# EAGLE design mit antenne_entfernt_3 (EAGLE 8.2.2)
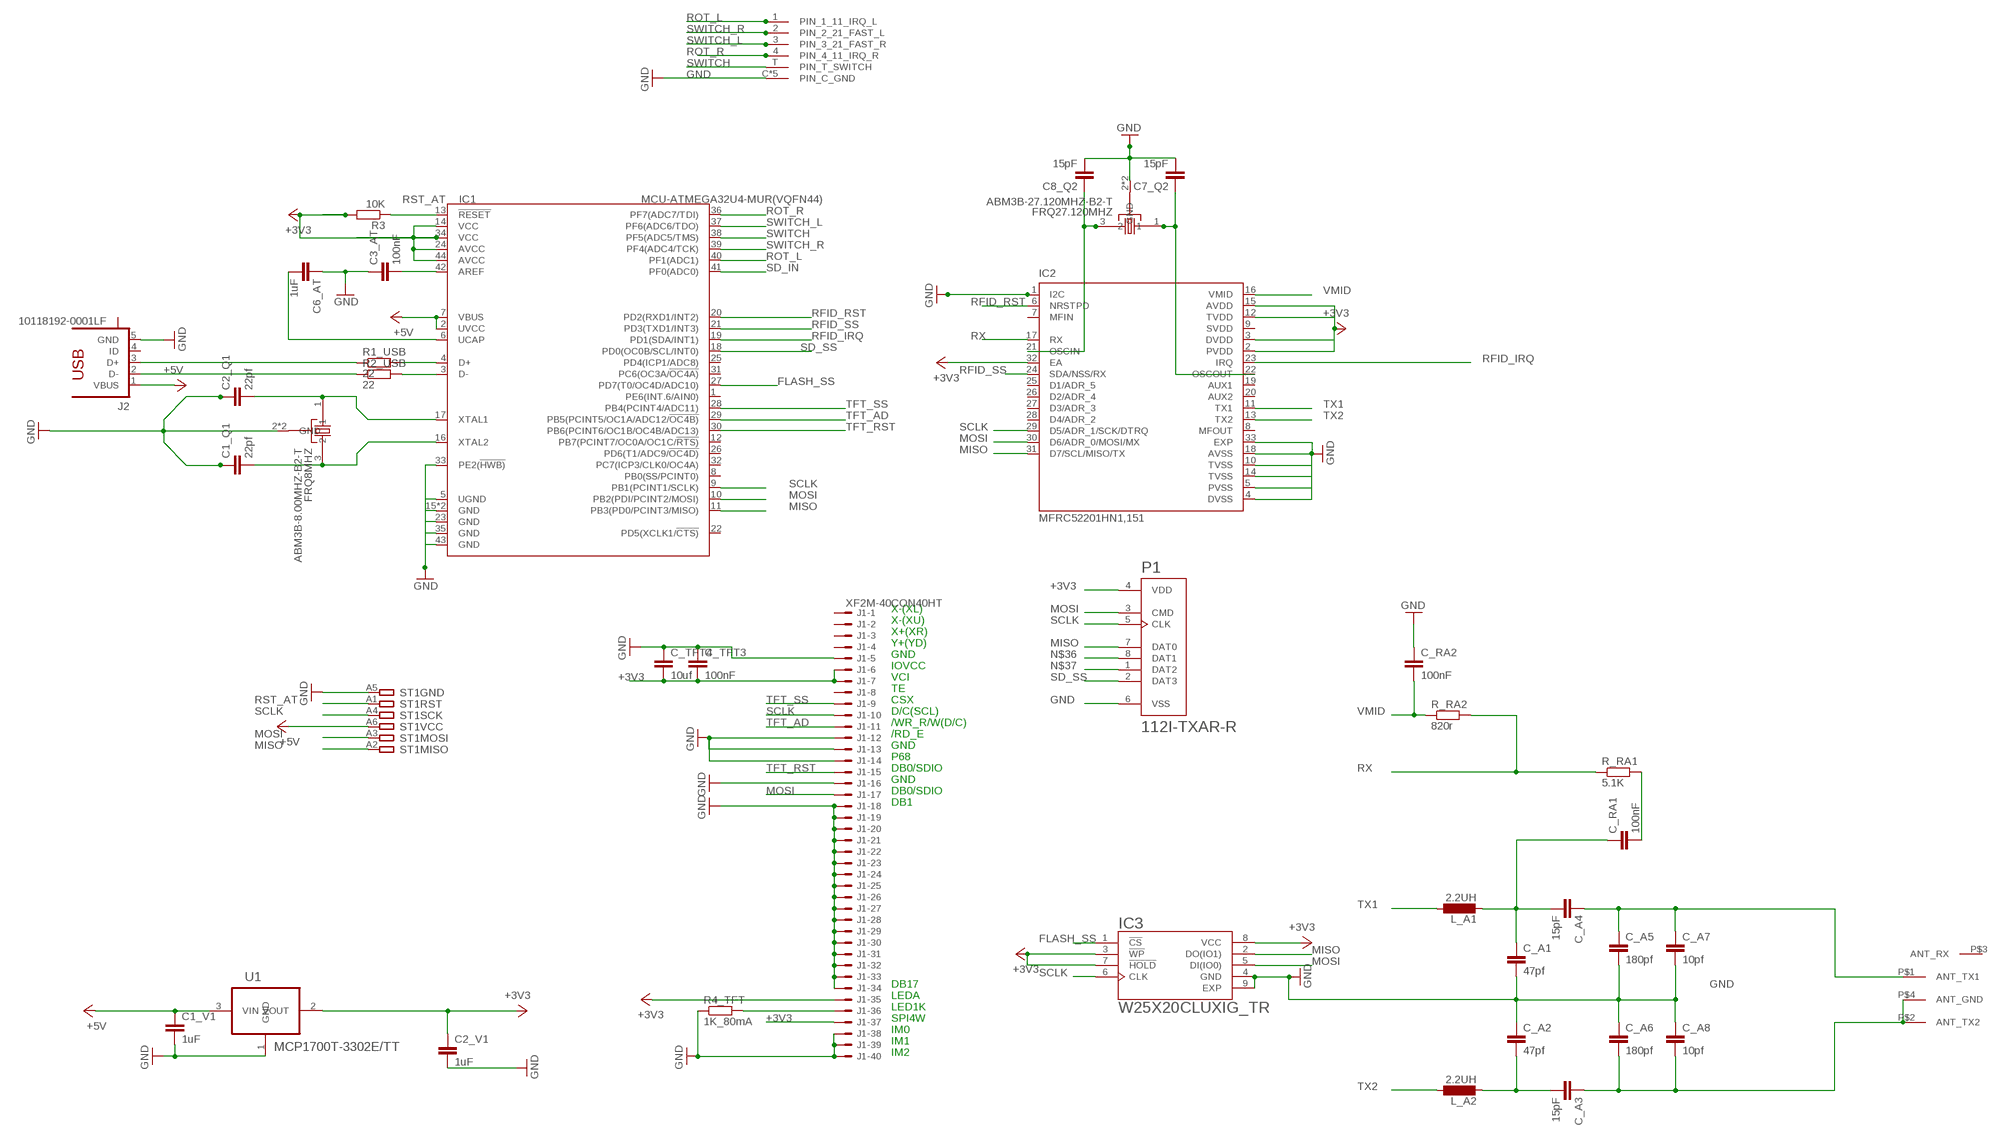
[diagram p0: schematic, sheet 1]

## Parts
C1_Q1  22pf  C-EUC0402K  [C0402K]
C1_V1  1uF  C-EUC0402K  [C0402K]
C2_Q1  22pf  C-EUC0402K  [C0402K]
C2_V1  1uF  C-EUC0402K  [C0402K]
C3_AT  100nF  C-EUC0402K  [C0402K]
C6_AT  1uF  C-EUC0402K  [C0402K]
C7_Q2  15pF  C-EUC0402K  [C0402K]
C8_Q2  15pF  C-EUC0402K  [C0402K]
C_A1  47pf  C-EUC0402K  [C0402K]
C_A2  47pf  C-EUC0402K  [C0402K]
C_A3  15pF  C-EUC0402K  [C0402K]
C_A4  15pF  C-EUC0603K  [C0603K]
C_A5  180pf  C-EUC0402K  [C0402K]
C_A6  180pf  C-EUC0402K  [C0402K]
C_A7  10pf  C-EUC0402K  [C0402K]
C_A8  10pf  C-EUC0402K  [C0402K]
C_RA1  100nF  C-EUC0402K  [C0402K]
C_RA2  100nF  C-EUC0402K  [C0402K]
C_TFT3  100nF  C-EUC0402K  [C0402K]
C_TFT4  10uf  C-EUC0402K  [C0402K]
FRQ8MHZ  ABM3B-8.00MHZ-B2-T  ABM3B-8.000MHZ-B2-T  [OSCSC500X320X110-4N]
FRQ27.120MHZ  ABM3B-27.120MHZ-B2-T  [OSCSC500X320X110-4N]
IC1  MCU-ATMEGA32U4-MUR(VQFN44)  [QFN44G-0.5-7X7MM]
IC2  MFRC52201HN1,151  [QFN50P500X500X100-33N]
IC3  W25X20CLUXIG_TR  [SON50P300X200X60-9N]
J1  XF2M-40CON40HT  [XF2M-4015-1F]
J2  10118192-0001LF  [10118192-0001LF]
L_A1  2.2UH  L-EUL2012C  [L2012C]
L_A2  2.2UH  L-EUL2012C  [L2012C]
P1  112I-TXAR-R  [112I-TXAR-R]
R1_USB  22  R-EU_R0402  [R0402]
R2_USB  22  R-EU_R0402  [R0402]
R3  10K  R-EU_R0402  [R0402]
R4_TFT  1K_80mA  R-EU_R0402  [R0402]
R_RA1  5.1K  R-EU_R0402  [R0402]
R_RA2  820r  R-EU_R0402  [R0402]
S1  WIPPSCHALTER_SCHWARZ_5WEGE  [SMD_SWITCH1]
S3  ANTENNE  [ANTENNE_ENIGMA_34X44]
ST1  ISA  IBM8BIT  [IBM8BIT]
U1  MCP1700T-3302E/TT  [SOT95P237X112-3N]

## Nets
+3V3: C2_V1.1 C_TFT3.2 C_TFT4.2 IC1.14(VCC) IC1.24(AVCC) IC1.34(VCC) IC1.44(AVCC) IC2.2(PVDD) IC2.3(DVDD) IC2.12(TVDD) IC2.15(AVDD) IC2.32(EA) IC3.3(!WP) IC3.7(!HOLD) IC3.8(VCC) J1.4 J1.6 J1.34 J1.35 P1.4(VDD) R3.2 U1.2(VOUT)
+5V: C1_V1.1 IC1.2(UVCC) IC1.7(VBUS) J2.1(VBUS) ST1.A6 U1.3(VIN)
FLASH_SS: IC1.27(PD7(T0/OC4D/ADC10)) IC3.1(!CS)
GND: C1_Q1.1 C1_V1.2 C2_Q1.1 C2_V1.2 C3_AT.1 C6_AT.1 C7_Q2.2 C8_Q2.2 C_A1.2 C_A2.1 C_A5.2 C_A6.1 C_A7.2 C_A8.1 C_RA2.1 C_TFT3.1 C_TFT4.1 FRQ8MHZ.2(GND) FRQ8MHZ.4(GND) FRQ27.120MHZ.2(GND) FRQ27.120MHZ.4(GND) IC1.5(UGND) IC1.15(GND) IC1.23(GND) IC1.33(PE2(!HWB)) IC1.35(GND) IC1.43(GND) IC1.TAB(GND) IC2.1(I2C) IC2.4(DVSS) IC2.5(PVSS) IC2.10(TVSS) IC2.14(TVSS) IC2.18(AVSS) IC2.33(EXP) IC3.4(GND) IC3.9(EXP) J1.1 J1.2 J1.3 J1.7 J1.8 J1.9 J1.10 J1.11 J1.12 J1.13 J1.14 J1.15 J1.16 J1.17 J1.18 J1.19 J1.20 J1.21 J1.22 J1.23 J1.25 J1.27 J1.28 J1.29 J1.36 J1.M1 J1.M2 J2.5(GND) P1.6(VSS) R4_TFT.1 S1.C(PIN_C_GND) S1.C_1(PIN_C_GND) S1.C_2(PIN_C_GND) S1.C_3(PIN_C_GND) S1.GND_TERMINAL(PIN_C_GND) ST1.A5 U1.1(GND)
MISO: IC1.11(PB3(PD0/PCINT3/MISO)) IC2.31(D7/SCL/MISO/TX) IC3.2(DO(IO1)) P1.7(DAT0) ST1.A2
MOSI: IC1.10(PB2(PDI/PCINT2/MOSI)) IC2.30(D6/ADR_0/MOSI/MX) IC3.5(DI(IO0)) J1.24 P1.3(CMD) ST1.A3
N$1: C1_Q1.2 FRQ8MHZ.3 IC1.16(XTAL2)
N$2: C2_Q1.2 FRQ8MHZ.1 IC1.17(XTAL1)
N$3: C8_Q2.1 FRQ27.120MHZ.3 IC2.21(OSCIN)
N$4: IC1.4(D+) R1_USB.2
N$5: IC1.3(D-) R2_USB.2
N$6: J2.3(D+) R1_USB.1
N$7: J2.2(D-) R2_USB.1
N$8: C7_Q2.1 FRQ27.120MHZ.1 IC2.22(OSCOUT)
N$9: C_A3.1 C_A6.2 C_A8.2 S3.P$2(ANT_TX2) S3.P$4(ANT_GND)
N$10: C3_AT.2 IC1.42(AREF)
N$13: C6_AT.2 IC1.6(UCAP)
N$15: J1.5 R4_TFT.2
N$21: C_RA1.2 R_RA1.2
N$23: C_A2.2 C_A3.2 L_A2.2
N$32: C_A1.1 C_A4.2 C_RA1.1 L_A1.2
N$33: C_A4.1 C_A5.1 C_A7.1 S3.P$1(ANT_TX1)
N$36: P1.8(DAT1)
N$37: P1.1(DAT2)
RFID_IRQ: IC1.19(PD1(SDA/INT1)) IC2.23(IRQ)
RFID_RST: IC1.20(PD2(RXD1/INT2)) IC2.6(NRSTPD)
RFID_SS: IC1.21(PD3(TXD1/INT3)) IC2.24(SDA/NSS/RX)
ROT_L: IC1.40(PF1(ADC1)) S1.1(PIN_1_11_IRQ_L)
ROT_R: IC1.36(PF7(ADC7/TDI)) S1.4(PIN_4_11_IRQ_R)
RST_AT: IC1.13(!RESET) R3.1 ST1.A1
RX: IC2.17(RX) R_RA1.1 R_RA2.2
SCLK: IC1.9(PB1(PCINT1/SCLK)) IC2.29(D5/ADR_1/SCK/DTRQ) IC3.6(CLK) J1.31 P1.5(CLK) ST1.A4
SD_IN: IC1.41(PF0(ADC0))
SD_SS: IC1.18(PD0(OC0B/SCL/INT0)) P1.2(DAT3)
SWITCH: IC1.38(PF5(ADC5/TMS)) S1.T(PIN_T_SWITCH)
SWITCH_L: IC1.37(PF6(ADC6/TDO)) S1.3(PIN_3_21_FAST_R)
SWITCH_R: IC1.39(PF4(ADC4/TCK)) S1.2(PIN_2_21_FAST_L)
TFT_AD: IC1.29(PB5(PCINT5/OC1A/ADC12/!OC4B)) J1.30
TFT_RST: IC1.30(PB6(PCINT6/OC1B/OC4B/ADC13)) J1.26
TFT_SS: IC1.28(PB4(PCINT4/ADC11)) J1.32
TX1: IC2.11(TX1) L_A1.1
TX2: IC2.13(TX2) L_A2.1
VMID: C_RA2.2 IC2.16(VMID) R_RA2.1
Unconnected: IC1.1(PE6(INT.6/AIN0)) IC1.8(PB0(SS/PCINT0)) IC1.12(PB7(PCINT7/OC0A/OC1C/!RTS)) IC1.22(PD5(XCLK1/!CTS)) IC1.25(PD4(ICP1/ADC8)) IC1.26(PD6(T1/ADC9/!OC4D)) IC1.31(PC6(OC3A/!OC4A)) IC1.32(PC7(ICP3/CLK0/OC4A)) IC2.7(MFIN) IC2.8(MFOUT) IC2.19(AUX1) IC2.20(AUX2) IC2.25(D1/ADR_5) IC2.26(D2/ADR_4) IC2.27(D3/ADR_3) IC2.28(D4/ADR_2) J1.33 J1.37 J1.38 J1.39 J1.40 J2.4(ID) J2.M1(S) J2.M2(S) J2.S1(S) J2.S2(S) J2.S3(S) J2.S4(S) S3.P$3(ANT_RX)

## Notes on the sheet
- X-(XL)
- X-(XU)
- X+(XR)
- Y+(YD)
- GND
- IOVCC
- VCI
- TE
- CSX
- D/C(SCL)
- /WR_R/W(D/C)
- /RD_E
- GND
- P68
- DB0/SDIO
- GND
- DB0/SDIO
- DB1
- DB17
- LEDA
- LED1K
- SPI4W
- IM0
- IM1
- IM2

## Power pins joined to a net without a drawn wire
SVDD: IC2.9(SVDD)

## Library data of the parts
C1_Q1 C1_V1 C2_Q1 C2_V1 C7_Q2 C8_Q2 C_A1-C_A8 C_RA1 C_RA2 C_TFT3 C_TFT4 = rcl:C-EU: CAPACITOR, European symbol
C3_AT C6_AT = resistor:C-EU: CAPACITOR, European symbol
FRQ8MHZ = ABM3B-8.000MHZ-B2-T:ABM3B-8.000MHZ-B2-T: Crystal 8.000MHz ±20ppm (Tol) ±50ppm (Stability) 18pF FUND 200Ohm 4-Pin CSMD T/R; AVAILABILITY: Good; DESCRIPTION: Crystal 8.000MHz %C2%B120ppm %28Tol%29 %C2%B150ppm %28Stability%29 18pF FUND 200Ohm 4-Pin CSMD T/R; MF: Abracon; MP: ABM3B-8.000MHZ-B2-T; PACKAGE: SMD-4 Abracon; PRICE: 0.44 USD
FRQ27.120MHZ = ABM3B-27.120MHZ-B2-T:ABM3B-27.120MHZ-B2-T: Crystal 27.120MHz ±20ppm (Tol) ±50ppm (Stability) 18pF FUND 200Ohm 4-Pin CSMD T/R; AVAILABILITY: Good; DESCRIPTION: Crystal 27.120MHz %C2%B120ppm %28Tol%29 %C2%B150ppm %28Stability%29 18pF FUND 200Ohm 4-Pin CSMD T/R; MF: Abracon; MP: ABM3B-27.120MHZ-B2-T; PACKAGE: SMD-4 Abracon; PRICE: 0.44 USD
IC1 = MCU-ATMEGA32U4-MUR_VQFN44_:MCU-ATMEGA32U4-MUR(VQFN44): 310010016; AVAILABILITY: Good; DESCRIPTION: ATmega Series 32 KB Flash 2.5 KB SRAM 16 MHz 8-Bit Microcontroller - MLF/QFN-44; MF: Atmel; MP: ATMEGA32U4-MUR; PACKAGE: QFN-44 Atmel; PRICE: 4.24 USD
IC2 = MFRC52201HN1_151:MFRC52201HN1,151: MFRC52201 Series 1.6 V - 3.6 V IC Smart Card Reader - VQFN-32; AVAILABILITY: Good; DESCRIPTION: MFRC52201 Series 1.6 V - 3.6 V IC Smart Card Reader - VQFN-32; MF: NXP Semiconductors; MP: MFRC52201HN1,151; PACKAGE: HVQFN-32 NXP Semiconductors; PRICE: 4.36 USD
IC3 = W25X20CLUXIG_TR:W25X20CLUXIG_TR: Ic Flash 2mbit 104mhz; AVAILABILITY: Good; DESCRIPTION: Ic Flash 2mbit 104mhz; MF: Winbond; MP: W25X20CLUXIG TR; PACKAGE: UFDFN-8 Winbond; PRICE: 0.47 USD
J1 = Custom_Cons:XF2*-40?: EastRising http://www.buydisplay.com/default/40-pin-0-5mm-pitch-top-contact-zif-connector-fpc-connector; BEISTELLUNG: JA; MF: EastRising; MPN: ER-CON40HT-1; OC_FARNELL: unknown; OC_NEWARK: unknown
J2 = Micro USB SMT Amphenol:10118192-0001LF: USB - microUSB Type B, FCI; AVAILABILITY: Good; DESCRIPTION: Conn Micro USB Type B RCP 5 POS 0.65mm Solder RA SMD 5 Terminal 1 Port T/R; MF: FCI; MP: 10118192-0001LF; PACKAGE: None; PRICE: 0.22 USD
L_A1 L_A2 = rcl:L-EU: INDUCTOR, European symbol
P1 = Custom_SD:112I-TXAR-R; AVAILABILITY: Good; DESCRIPTION: Conn Micro SD Card HDR 8 POS 1.1mm Solder RA SMD Embossed T/R 0.5A; LIEFERANT: Conrad Elektronik; LIEFERANTEN_ART_NR: 1308329 - 05; MF: ATTEND; MP: 112I-TXAR-R; PACKAGE: None; PRICE: 1.11 USD
R1_USB R2_USB R3 R4_TFT R_RA1 R_RA2 = resistor:R-EU_: RESISTOR, European symbol
S1 = Alps_switch:WIPPSCHALTER_SCHWARZ_5WEGE; LIEFERANT: MOUSER; LIEFERANT_ART_NR: 688-SLLB120300; MF: Alps; MP: SLLB120300
S3 = RFID_Antennen:ANTENNE: Nur Leiterbahnen/Pads kein Bauteil!
ST1 = Custom_Cons:IBM8BIT: Nur Leiterbahnen/Pads kein Bauteil!
U1 = MCP1700T-3302E_TT:MCP1700T-3302E/TT: Low Quiescent Current LDO; AVAILABILITY: Good; DESCRIPTION: MCP1700 Series 250 mA 3.3 V Fixed Output LDO Voltage Regulator - SOT-23; MF: Microchip; MP: MCP1700T-3302E/TT; PACKAGE: SOT-23-3 Microchip; PRICE: 0.35 USD

## Board
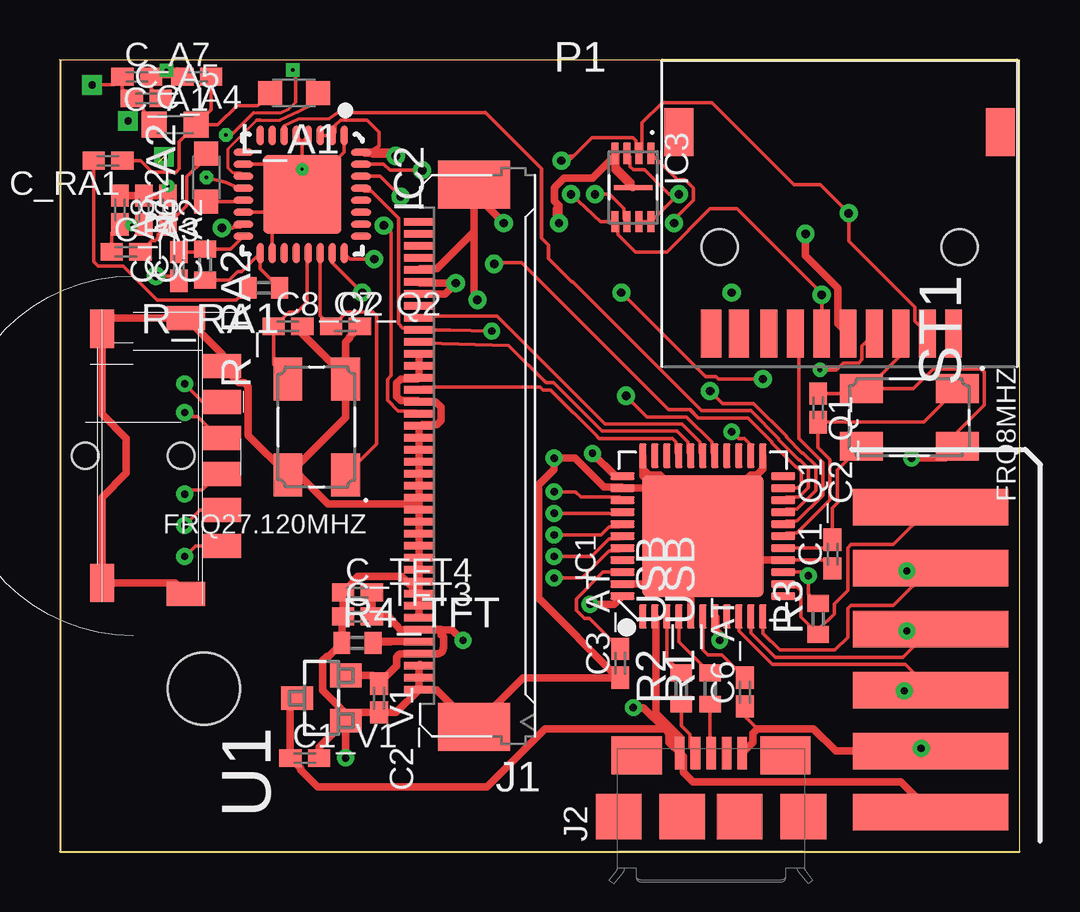
[diagram p1: board, top side]
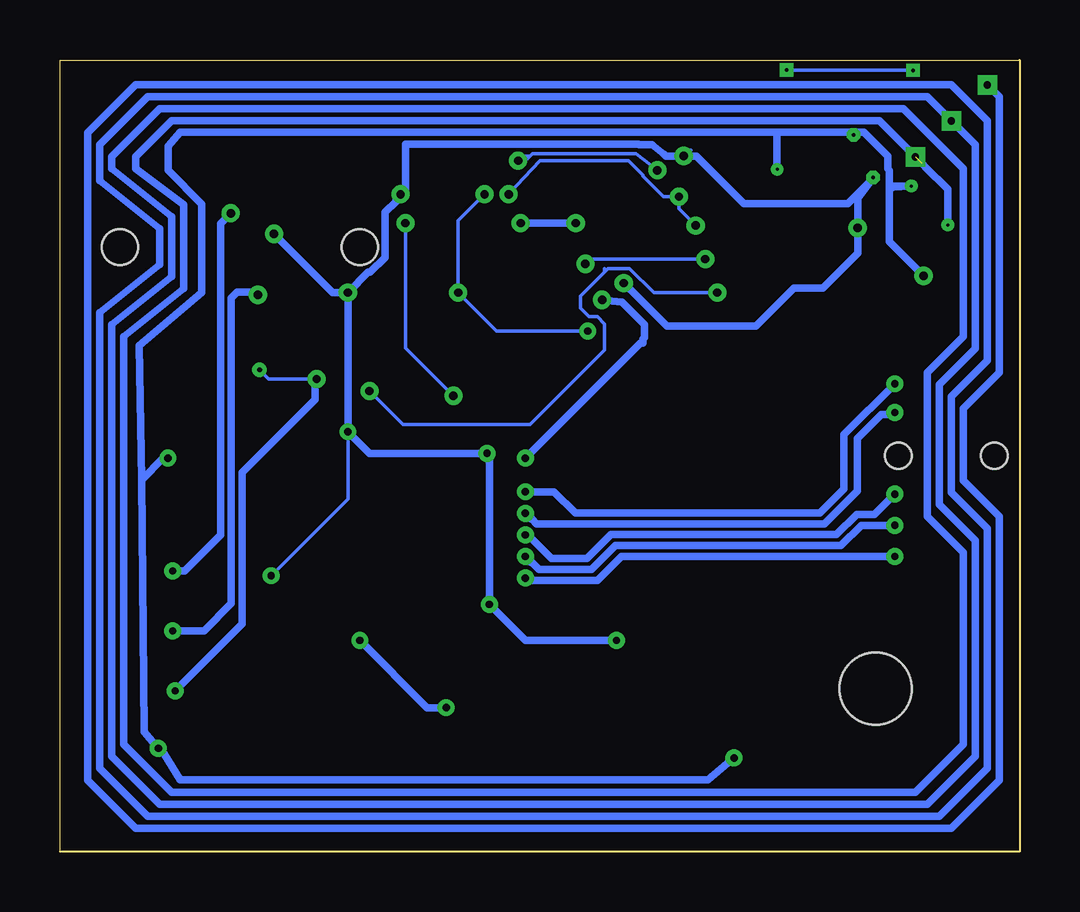
[diagram p2: board, bottom side, seen from below]

Size 40 x 33 mm. Coordinates in mm from the lower left corner, seen from the top.
Outline: 0,0 40,0 40,33 0,33 0,0
Copper layers (1*16): Top 0.035mm / dielectric 1.5mm / Bottom 0.035mm
Design rules "default *": minimum track width 0.125mm, minimum drill 0.125mm, track to track 0.15mm, track to pad 0.15mm, pad to pad 0.15mm, via to via 0.15mm, smd to smd 0.15mm, copper to edge 0.15mm, drill to drill 0.15mm, minimum pad ring 10mil, minimum via ring 8mil, stop-mask expansion 4mil, vias tented up to drill 0mil, thermal gap 10mil
Holes 3 mm at 6,6.8

### Footprints (pad centres in the part's own frame; a part is rotated, then mirrored left to right if it is on the bottom)
C0402K = smd 0.925 x 0.74: 1 -0.6,0; 2 0.6,0
C0603K = smd 1.05 x 1.08: 1 -0.875,0; 2 0.875,0
OSCSC500X320X110-4N = smd 1.2 x 1.8: 1 -1.2,2; 2 -1.2,-2; 3 1.2,-2; 4 1.2,2
QFN44G-0.5-7X7MM = smd 1 x 0.3: 1 -3.35,2.5; 2 -3.35,2; 3 -3.35,1.5; 4 -3.35,1; 5 -3.35,0.5; 6 -3.35,0; 7 -3.35,-0.5; 8 -3.35,-1; 9 -3.35,-1.5; 10 -3.35,-2; 11 -3.35,-2.5; 23 3.35,-2.5; 24 3.35,-2; 25 3.35,-1.5; 26 3.35,-1; 27 3.35,-0.5; 28 3.35,0; 29 3.35,0.5; 30 3.35,1; 31 3.35,1.5; 32 3.35,2; 33 3.35,2.5 | smd 0.3 x 1: 12 -2.5,-3.35; 13 -2,-3.35; 14 -1.5,-3.35; 15 -1,-3.35; 16 -0.5,-3.35; 17 0,-3.35; 18 0.5,-3.35; 19 1,-3.35; 20 1.5,-3.35; 21 2,-3.35; 22 2.5,-3.35; 34 2.5,3.35; 35 2,3.35; 36 1.5,3.35; 37 1,3.35; 38 0.5,3.35; 39 0,3.35; 40 -0.5,3.35; 41 -1,3.35; 42 -1.5,3.35; 43 -2,3.35; 44 -2.5,3.35 | smd 5.08 x 5.08: TAB 0,0
QFN50P500X500X100-33N = smd 0.85 x 0.3: 1 -2.45,1.75; 2 -2.45,1.25; 3 -2.45,0.75; 4 -2.45,0.25; 5 -2.45,-0.25; 6 -2.45,-0.75; 7 -2.45,-1.25; 8 -2.45,-1.75; 17 2.45,-1.75; 18 2.45,-1.25; 19 2.45,-0.75; 20 2.45,-0.25; 21 2.45,0.25; 22 2.45,0.75; 23 2.45,1.25; 24 2.45,1.75 | smd 0.3 x 0.85: 9 -1.75,-2.45; 10 -1.25,-2.45; 11 -0.75,-2.45; 12 -0.25,-2.45; 13 0.25,-2.45; 14 0.75,-2.45; 15 1.25,-2.45; 16 1.75,-2.45; 25 1.75,2.45; 26 1.25,2.45; 27 0.75,2.45; 28 0.25,2.45; 29 -0.25,2.45; 30 -0.75,2.45; 31 -1.25,2.45; 32 -1.75,2.45 | smd 3.25 x 3.25: 33 0,0
SON50P300X200X60-9N = smd 0.89 x 0.3: 1 -1.42,0.75; 2 -1.42,0.25; 3 -1.42,-0.25; 4 -1.42,-0.75; 5 1.42,-0.75; 6 1.42,-0.25; 7 1.42,0.25; 8 1.42,0.75 | smd 0.2 x 1.6: 9 0,0
XF2M-4015-1F = smd 1.25 x 0.3: 1 2.54,9.75; 2 2.54,9.25; 3 2.54,8.75; 4 2.54,8.25; 5 2.54,7.75; 6 2.54,7.25; 7 2.54,6.75; 8 2.54,6.25; 9 2.54,5.75; 10 2.54,5.25; 11 2.54,4.75; 12 2.54,4.25; 13 2.54,3.75; 14 2.54,3.25; 15 2.54,2.75; 16 2.54,2.25; 17 2.54,1.75; 18 2.54,1.25; 19 2.54,0.75; 20 2.54,0.25; 21 2.54,-0.25; 22 2.54,-0.75; 23 2.54,-1.25; 24 2.54,-1.75; 25 2.54,-2.25; 26 2.54,-2.75; 27 2.54,-3.25; 28 2.54,-3.75; 29 2.54,-4.25; 30 2.54,-4.75; 31 2.54,-5.25; 32 2.54,-5.75; 33 2.54,-6.25; 34 2.54,-6.75; 35 2.54,-7.25; 36 2.54,-7.75; 37 2.54,-8.25; 38 2.54,-8.75; 39 2.54,-9.25; 40 2.54,-9.75 | smd 3 x 2: M1 0.25,11.3; M2 0.25,-11.3
10118192-0001LF = smd 0.4 x 1.35: 1 -1.3,4.1; 2 -0.65,4.1; 3 0,4.1; 4 0.65,4.1; 5 1.3,4.1 | smd 1.9 x 1.9: M1 -1.2,1.45; M2 1.2,1.45; S1 -3.85,1.45; S2 3.85,1.45 | smd 2.1 x 1.6: S3 -3.1,4; S4 3.1,4
L2012C = smd 1 x 1: 1 -1,0; 2 1,0
112I-TXAR-R = smd 0.7 x 2: 1 2.95,3.6; 2 1.85,3.6; 3 0.75,3.6; 4 -0.35,3.6; 5 -1.45,3.6; 6 -2.55,3.6; 7 -3.65,3.6; 8 -4.75,3.6 | smd 0.85 x 2: CD 5.35,3.6; GND 4.2,3.6 | smd 1.2 x 2: PAD -6.7,-4.8; PAD. 6.7,-4.8 | hole 1.5: -5,0; 5,0
R0402 = smd 0.7 x 0.9: 1 -0.65,0; 2 0.65,0
SMD_SWITCH1 = smd 1 x 1.6: 1 -3.75,-3.7; 2 -2.25,-3.7; 3 0.75,-3.7; 4 2.25,-3.7; C 3.75,-3.7; C_2 5.75,-2.2; C_3 -5.75,-2.2; T -0.75,-3.7 | smd 1.6 x 1: C_1 5.3,1.3; GND_TERMINAL -5.3,1.3 | hole 1.1: 0,-2; 0,2
ANTENNE_ENIGMA_34X44 = drill 0.3 square: P$1 -18.5,16; P$2 -15.5,13; P$3 -17,14.5; P$4 -15.5,13
IBM8BIT = smd 1.524 x 6.477: A1 6.35,0; A2 3.81,0; A3 1.27,0; A4 -1.27,0; A5 -3.81,0; A6 -6.35,0
SOT95P237X112-3N = smd 0.991 x 1.321: 1 -0.94,-1.016; 2 0.94,-1.016; 3 0,1.016

### Placement (x,y rotation side)
C1_Q1  32.2,12.4 90 top
C1_V1  10.2,3.9 0 top
C2_Q1  31.6,18.5 270 top
C2_V1  13.3,6.4 270 top
C3_AT  23.35,7.85 90 top
C6_AT  28.55,6.65 90 top
C7_Q2  11.9,21.9 0 top
C8_Q2  9.5,21.9 0 top
C_A1  5.7,32.3 180 top
C_A2  4.5,26.75 270 top
C_A3  2.75,25 0 top
C_A4  4.8,30.3 0 top
C_A5  3.6,31.4 0 top
C_A6  3.5,26.75 270 top
C_A7  3.2,32.3 0 top
C_A8  2.5,26.75 270 top
C_RA1  2,28.8 180 top
C_RA2  4.96,24.39 90 top
C_TFT3  12.4,9.8 0 top
C_TFT4  12.4,10.8 0 top
FRQ8MHZ  35.4,18.1 270 top
FRQ27.120MHZ  10.7,17.7 180 top
IC1  26.8,13.15 90 top
IC2  10.1,27.4 270 top
IC3  23.89,27.68 270 top
J1  17.5,16.5 180 top
J2  27.14,0.01 0 top
L_A1  9.75,31.62 180 top
L_A2  6.1,28.1 90 top
P1  32.5,25.2 180 top
R1_USB  27.1,6.8 90 top
R2_USB  25.9,6.8 90 top
R3  31.6,9.7 90 top
R4_TFT  12.4,8.7 0 top
R_RA1  8.5,23.5 180 top
R_RA2  6.05,24.47 270 top
S1  3.05,16.5 90 top
S3  19.84,15.96 0 top
ST1  36.3,8 90 top
U1  10.9,6.4 90 top

### Tracks (layer width: path | path; a pad name or v marks a point on that pad's centre or on a via)
+3V3  (via drill 0.15, 0.3, 0.35)
  Top 0.125: v6.1,28.1 6.14,28.05 6.28,28.05
  Top 0.15: IC1.14 31.05,11.65 v31.2,11.5 31.2,10.75 R3.2 | v28,17.5 28.27,17.23 28.52,17.23 28.8,16.95 IC1.24 | 7.35,26.15 IC2.15 7.53,26.02 7.22,26.02 7.2,26 v6.75,26 | IC2.3 IC2.2 11.47,29.98 11.47,30.28 11.7,30.5 12.8,30.5 13.3,30 13.3,29.4 12.75,29.05 IC2.32 12.67,29.02 12.98,29.02 13.01,29 v14,29 | IC2.12 7.42,27.68 6.89,27.9 6.28,28.05 | IC3.3 23.77,28.98 23.77,28.56 23.9,28.43 24.36,28.43 25.39,27.4 25.78,27.4 | v25.8,27.4 25.78,27.4 | 25.78,27.4 IC3.8 IC3.7 | 15.06,8.2 15.1,8.25 | 14.89,8.32 14.81,8.25
  Top 0.305: J1.6 14.9,9.25 14.2,9.24 13.71,9.8 13.12,9.8 | 13.12,9.8 C_TFT3.2 | C_TFT4.2 13,9.93 13.12,9.8 | J1.6 15.15,9.26 15.88,9.26 15.89,9.03 arc-90 15.98,8.93 15.98,8.49 arc-90 15.74,8.25 15.1,8.25 14.81,8.25 | 13.34,7.04 14.03,7.73 14.03,8.03 arc-90 14.26,8.25 14.81,8.25 | U1.2 13.04,7.34 13.34,7.04 | J1.6 16.35,9.25 v16.8,8.8 | IC1.34 23.15,15.65 v22.2,16.6 | v22.1,10.3 23.1,10.3 IC1.44 | J1.34 16.05,23.25 v16.5,23.7 15.01,23.7 J1.35 | IC2.32 13.85,29.15 v14,29 | C2_V1.1 13.34,7.04 | J1.4 14.82,8.25 14.81,8.25 | v31.08,25.75 31.08,24.84 32.43,23.49 32.43,22.02 P1.4
  Bottom 0.125: 6.31,27.83 6.1,28.04 v6.1,28.1
  Bottom 0.15: v28,17.5 28,14.7 v31.2,11.5 | 13.75,29.25 13.69,29.25 13.94,29 v14,29
  Bottom 0.305: v16.8,8.8 20.6,8.8 v22.1,10.3 22.1,16.5 v22.2,16.6 27.1,16.6 v28,17.5 v28,23.3 | 13.93,29.07 v14,29 | v16.5,23.7 14.7,21.9 11,21.9 9.4,23.5 8.2,23.5 6.75,24.95 v6.75,26 6.75,27.25 6.31,27.83 6.19,27.99 7.16,27.01 11.48,27.01 13.47,29 v14,29 | v28,23.3 27.15,24.15 27.06,24.15 26.45,24.76 26.45,26.65 26,27.1 | 26,27.1 25.7,27.4 | v14,29 14.74,29 14.82,29.08 15.33,29.48 15.65,29.48 15.87,29.48 15.89,29.49 16,29.48 16.42,29.48 25.58,29.48 25.6,29.5 25.6,27.6 v25.8,27.4 26,27.2 26,27.1 | v28,23.3 28.63,23.3 v31.08,25.75
+5V  (via drill 0.3)
  Top 0.305: J2.1 25.99,3.96 25.99,3.31 26.39,2.91 35.04,2.91 ST1.A6 | 25.21,5.11 25.39,4.93 | J2.1 25.39,4.56 25.39,4.93 | 25.21,5.11 20.21,5.11 17.8,2.7 10.74,2.7 10.04,3.4 10.04,3.46 C1_V1.1 9.6,6.12 U1.3 | v27.5,8.8 27.5,9.04 27.35,9.2 27.35,9.75 IC1.7 | 25.84,4.44 J2.1 | 25.84,4.44 25.84,4.77 24.85,5.76 24.85,9.75 IC1.2 | 25.21,5.11 25.39,4.93 | 25.39,4.93 25.39,4.89 25.84,4.44 | 25.21,5.11 24.33,6 v23.9,6
  Bottom 0.305: v23.9,6 24.7,6 v27.5,8.8
FLASH_SS  (via drill 0.35)
  Top 0.15: IC1.27 27.18,16.62 27.18,17.07 26.12,18.12 24.48,18.12 v23.6,19 | IC3.1 25.74,28 26.05,28 26.4,27.65 26.4,27.15 25.6,26.35 v25.6,26.2
  Bottom 0.15: v25.6,26.2 25.6,21 v23.6,19
GND  (via drill 0.12, 0.15, 0.3, 0.35)
  Top 0.125: 9.83,31.24 9.55,30.96 9.21,30.8 8.07,30.8 | IC2.33 v10.1,28.44
  Top 0.15: 26.63,12.98 IC1.TAB 26.67,13.28 26.62,13.33 | 26.63,12.98 26.3,12.65 26.3,11.63 26.3,11.24 | 26.3,11.24 IC1.5 | 25.47,11.15 26.21,11.15 26.3,11.24 | 24.92,15.03 26.62,13.33 | 27.68,14.58 26.9,13.8 26.9,13.61 26.62,13.33 | 28.3,12.2 27.41,12.2 26.63,12.98 | IC1.15 31.85,12.15 C1_Q1.1 | C6_AT.1 28.55,5.63 29.07,5.11 | FRQ8MHZ.4 37.4,17.48 38.52,18.61 38.52,19.99 38.39,20.12 36.41,20.12 35.58,19.3 33.66,19.3 | 33.66,19.3 FRQ8MHZ.2 33.2,19.1 C2_Q1.1 | FRQ27.120MHZ.2 11.9,19.79 11.9,21.3 C7_Q2.2 | C3_AT.1 23.26,7.25 19.3,7.25 | J2.5 28.96,4.57 28.96,4.9 29.1,5.04 29.5,5.04 29.59,5.11 | ST1.A5 34.9,4.19 | 11.85,29.75 | v4,24 4.75,24 C_RA2.1 | 4.54,31.16 4.43,31.16 C_A5.2 3.8,31.8 C_A7.2 C_A1.2 5.03,32.5 4.9,32.63 v4.44,32.57 | J1.7 | IC3.9 23.89,27.94 23.27,28.56 23.27,28.98 23.18,29.06 IC3.4 22.04,28 21.05,28 20.7,27.65 20.7,27.15 20.7,26.8 | P1.6 35.05,20.69 33.66,19.3 | 8.07,30.8 7.18,29.91 v6.91,29.88 | 9.83,31.24 9.83,32.36 9.6,32.59 | 9.6,32.59 9.55,32.64 | v9.71,32.58 9.64,32.63 9.6,32.59
  Top 0.152: IC2.10 10.02,28.65 10.51,28.16 10.51,27.81 | 10.51,27.81 IC2.33 9.35,26.65 | IC2.14 9.35,26.65 | 10.1,29.6 IC2.5 | v10.1,28.44 10.1,29.6 | 10.1,29.6 IC2.4 | IC2.1 11.85,29.75 11.85,29.15 10.51,27.81 | IC2.18 8.85,26.15 9.35,26.65 | 4.51,27.68 C_A2.1
  Top 0.305: 25.47,11.15 IC1.43 | 24.8,15.15 IC1.35 23.41,15.2 22.68,15.2 21.47,16.4 v20.6,16.4 20.6,15.93 19.94,15.27 19.94,10.57 23.26,7.25 | 24.8,15.15 24.92,15.03 | 24.8,15.15 24.3,15.65 IC1.33 24.3,15.94 24.55,15.7 25,15.7 26.9,13.8 | 29.05,15.7 28.8,15.7 27.68,14.58 | IC1.23 29.3,15.94 29.05,15.7 | 28.3,12.2 28.35,12.15 IC1.15 | 26.3,11.63 IC1.5 26.3,12.92 26.67,13.28 | U1.1 12.26,5.8 C2_V1.2 14.01,5.8 J1.1 | U1.1 11.92,5.76 10.95,6.72 10.95,7.96 11.13,8.14 11.19,8.14 R4_TFT.1 11.75,9.75 C_TFT3.1 C_TFT4.1 12.23,11.23 12.23,11.29 12.41,11.47 14.24,11.47 J1.9 | J1.1 15.7,6.75 J1.M1 19.3,7.25 C3_AT.1 | J1.1 J1.2 J1.3 15,7.79 | J1.7 J1.8 J1.9 | J1.9 J1.10 J1.11 J1.12 J1.13 J1.14 J1.15 J1.16 14.96,14.43 | 14.96,14.43 J1.17 J1.18 J1.19 J1.20 J1.21 J1.22 14.96,17.65 | 14.96,17.65 J1.23 | J1.29 J1.28 J1.27 14.91,19.7 14.21,19.7 14.03,19.52 14.03,18.98 14.21,18.8 14.91,18.8 J1.25 15.66,18.75 15.89,18.52 15.89,17.98 15.71,17.8 15.11,17.8 14.96,17.65 | FRQ27.120MHZ.4 11.9,18.1 FRQ27.120MHZ.2 11.9,21.24 12.06,21.41 12.06,21.46 C7_Q2.2 | C8_Q2.2 10.1,21.59 11.9,19.79 | FRQ27.120MHZ.4 9.97,15.7 11.18,14.5 14.89,14.5 14.96,14.43 | FRQ27.120MHZ.4 7.85,17.35 7.85,19.38 7.67,19.55 7.45,19.55 S1.C 6.75,20.75 S1.C_2 2.2,22.25 S1.C_1 1.75,18.23 2.77,17.21 2.77,15.79 1.75,14.77 S1.GND_TERMINAL 4.8,11.2 S1.C_3 | J1.36 15.01,24.3 15.71,24.3 17.25,25.84 J1.M2 | C1_V1.2 10.8,4.34 11.9,5.44 | v11.9,3.9 11.9,5.44 | 11.9,5.44 U1.1 | J2.5 28.89,4.56 28.89,4.93 29.07,5.11 29.59,5.11 31.41,5.11 32.34,4.19 34.9,4.19 | ST1.A5 36.01,4.19 v35.9,4.3 | v35.5,16.4 36.9,16.4 FRQ8MHZ.4 | 4.34,27.51 C_A2.1 C_A6.1
  Top 0.305: C_A6.1 C_A8.1 | J1.M2 17.25,23.35 v17.4,23 | 29.05,15.7 26.8,13.44 IC1.TAB | J1.M2 17.25,27.45 v18.5,26.2 | 20.7,26.8 20.7,26.3 v20.8,26.2 20.8,26.94 20.62,27.12 20.62,27.68 21.02,28.08 22.2,28.08 23.18,29.06 | IC3.4 23.14,28.43 IC3.9 | C_A6.1 4.17,27.35 v4.51,27.75
  Bottom 0.125: 9.59,32.57 v9.71,32.58
  Bottom 0.15: v35.9,4.3 35.66,4.06 | v4.44,32.57 9.59,32.57 | v9.71,32.58 9.72,32.63 | v6.91,29.88 6.78,29.91 6.69,30
  Bottom 0.305: v35.9,4.3 36.5,5 36.6,15.5 | v11.9,3.9 13,3 35,3 35.66,4.06 | v35.5,16.4 35.7,16.4 36.6,15.5 | 36.6,15.5 36.7,21.1 34.1,23.3 34.1,27 35.5,28.4 35.5,29.4 35,30 10.12,30 | 10.12,30 6.69,30 6.5,30 5.5,29 5.5,28.46 5.42,28.38 5.42,27.73 | v17.4,23 16.57,22.9 15.64,21.97 15.64,21.43 15.7,21.37 15.7,21.2 15.8,21.2 v20.6,16.4 | v18.5,26.2 v20.8,26.2 | v4,24 5.42,25.42 5.42,27.57 | 5.42,27.57 5.42,27.73 | 5.42,27.57 5.29,27.7 v4.51,27.75 4.55,27.73 5.42,27.73 | 10.12,30 10.12,28.46 v10.1,28.44
MISO  (via drill 0.3, 0.35)
  Top 0.15: IC1.11 29.3,9.1 30,8.4 32.3,8.4 32.84,8.94 32.84,10.12 32.97,10.26 34.75,10.26 ST1.A2 35.41,11.81 v35.3,11.7 | IC2.31 13.5,28.65 13.75,28.4 14.1,28.4 v15.1,28.4 | 21.4,29 22.17,29.77 23.88,29.77 24.02,29.64 24.02,29.23 IC3.2 24.27,29.23 24.27,30.38 25.11,31.23 27.18,31.23 30.6,27.8 31.69,27.8 v32.88,26.61 32.88,25.44 35.62,22.69 35.62,22.12 P1.7 | 21.4,29 21.2,28.8 | 21.4,29 21.1,29 v20.9,28.8
  Bottom 0.15: 20.6,28.8 20.4,29 | 20.4,29 20.3,29.1 16,29.1 v15.1,28.4 | 20.4,29 20.7,29 v20.9,28.8 20.9,29
  Bottom 0.305: v35.3,11.7 34.8,11.7 33.31,13.19 33.31,23.59 | 33.31,23.59 33.3,23.6 | 33.31,23.59 33.31,26.18 v32.88,26.61
MOSI  (via drill 0.3, 0.35)
  Top 0.15: IC1.10 28.8,9.12 29.82,8.1 35.13,8.1 ST1.A3 35.37,9.27 v35.3,9.2 | v13.5,26.1 13.81,25.79 13.81,19.83 13.65,19.68 13.65,18.82 14.1,18.37 14.84,18.37 J1.24 | IC2.30 13.35,28.15 v14.2,27.3 | v21.3,27.4 22.54,26.26 IC3.5 23.27,26.14 23.27,25.72 23.99,25 25.3,25 27.1,26.8 28.21,26.8 31.75,23.26 v31.75,23.21 P1.3
  Top 0.152: 12.86,28.15 IC2.30
  Bottom 0.15: v13.5,26.1 14.2,26.8 v14.2,27.3 14.85,27.3 15.7,28.15 15.7,28.2 16.3,28.8 20,28.8 v21.3,27.4
  Bottom 0.305: v35.3,9.2 34,9.2 32.85,10.35 32.85,23.08 32.62,23.32 31.86,23.32 v31.75,23.21
N$1
  Top 0.15: IC1.16 31.85,12.65 C1_Q1.2 32.2,14.33 32.4,14.53 32.4,15.9 FRQ8MHZ.3
N$2
  Top 0.15: IC1.17 30.27,13.28 30.72,13.28 32.1,14.65 32.1,16.34 31.6,16.84 C2_Q1.2 36,17.9 FRQ8MHZ.1
N$3
  Top 0.15: IC2.21 10.3,24.9 10.3,22.9 9.89,22.5 9.54,22.5 8.95,21.9 C8_Q2.1 8.9,20.3 FRQ27.120MHZ.3
N$4
  Top 0.15: IC1.4 25.8,8.75 R1_USB.2
N$5
  Top 0.15: IC1.3 25.3,8.05 R2_USB.2
N$6
  Top 0.15: R1_USB.1 27.1,4.15 J2.3
N$7
  Top 0.15: J2.2 26.27,4.33 26.27,4.88 25.9,5.24 R2_USB.1
N$8
  Top 0.15: IC2.22 10.85,22.35 C7_Q2.1 11.35,21.9 11.94,22.5 13.06,22.5 13.19,22.36 13.19,22.21 13.2,22.2 13.2,17 FRQ27.120MHZ.1
N$9  (via drill 0.12)  (1 unrouted)
  Top 0.125: C_A6.2 3.05,26.15 | C_A8.2 2.53,26.12 v2.99,26.12
  Top 0.15: C_A3.1 2.15,25.8 C_A8.2 | 3.05,26.15 C_A8.2 | C_A8.2 2.5,26.2
  Bottom 0.125: 2.99,26.88 v2.99,26.12 | 3.92,28.54 4.08,28.7
  Bottom 0.15: 2.99,26.88 2.99,27.61 3.54,28.16 | 3.54,28.16 3.78,28.4 | 3.54,28.16 3.92,28.54 4.02,28.64 4.07,28.69
  Bottom 0.305: v2.99,26.12 2.99,26.88 2.99,27.61 3.92,28.54 4.02,28.64
N$10
  Top 0.15: IC1.42 22.63,11.65 21.52,10.54 21.52,10.06 21.86,9.72 22.08,9.72 C3_AT.2
N$13
  Top 0.15: IC1.6 26.8,8.4 27,8.2 27.6,8.2 C6_AT.2
N$15
  Top 0.305: R4_TFT.2 14.21,8.76 13.41,8.76 14.91,8.76 J1.5
N$21
  Top 0.15: C_RA1.2 1.4,24.6 1.59,24.41 2.65,24.41 4.05,23 7.35,23 R_RA1.2
N$23
  Top 0.15: C_A3.2 3.81,25.46 3.96,25.46 4.09,25.59 4.09,25.75 C_A2.2 5.28,26.93 5.28,28.13 6,28.85 L_A2.2
N$32
  Top 0.15: 8.5,31.87 L_A1.2 8.23,31.1 7.38,31.1 6.58,30.3 C_A4.2 | C_RA1.1 3.37,28.8 3.84,28.33 4.84,28.33 4.97,28.46 4.97,29.59 C_A4.2 | C_A1.1 6.3,30.93 C_A4.2
N$33
  Top 0.15: S3.P$1 2.26,31.96 C_A7.1 2.6,31.8 C_A5.1 3.31,31.09 3.34,31.09 3.47,30.96 3.47,30.93 C_A4.1
RFID_IRQ  (via drill 0.35)
  Top 0.15: IC1.19 30.27,14.28 30.72,14.28 31.5,15.05 31.5,16.09 30.97,16.62 30.92,16.62 30.27,17.27 30.27,17.32 28.92,18.68 27.62,18.68 v27.1,19.2 | IC2.23 11.35,24.55 v12.6,23.3
  Bottom 0.15: v12.6,23.3 15.25,23.3 16.25,24.3 17.15,24.3 17.3,24.15 | 17.3,24.3 17.3,24.15 | 17.3,24.15 18.3,23.15 18.3,22.65 17.95,22.3 17.6,22.3 17.3,22 17.3,20.9 20.4,17.8 25.7,17.8 v27.1,19.2 27.2,19.3
RFID_RST
  Top 0.125: 9.32,29.96 9.32,30.26 9.95,30.55 11.21,30.55
  Top 0.15: IC1.20 30.27,14.78 30.8,14.78 31.2,15.18 31.2,15.97 30.85,16.32 30.8,16.32 29.98,17.15 29.98,17.2 28.79,18.38 26.75,18.38 21.36,23.76 21.32,23.76 20.36,24.72 20.36,25.29 20.07,25.58 20.07,28.46 17.72,30.81 17.7,30.8 11.57,30.8 11.21,30.55 | IC2.6 9.32,29.96
RFID_SS  (via drill 0.35)
  Top 0.15: IC1.21 30.75,15.15 30.9,15.3 30.9,15.85 30.72,16.02 30.68,16.02 29.68,17.02 29.68,17.07 28.67,18.08 26.8,18.08 | 26.8,18.08 26.62,18.08 | 26.71,18.08 26.59,18.08 26.25,18.43 25.8,18.43 | 25.8,18.43 25.36,18.43 19.24,24.55 18.7,24.55 | 18.7,24.55 18.16,24.55 | v13.1,24.7 12.1,24.7 IC2.24 | 25.8,18.43 26.27,18.43 26.62,18.08 | 26.62,18.08 26.8,18.08 | 18.7,24.55 18.15,24.55 v18.1,24.5
  Bottom 0.15: v13.1,24.7 17.9,24.7 v18.1,24.5
ROT_L  (via drill 0.3)
  Top 0.15: S1.1 5.65,12.75 v5.2,12.3 | IC1.40 23.32,12.53 22.88,12.53 21.75,11.4 v20.6,11.4
  Bottom 0.305: v5.2,12.3 16.6,12.3 17.6,11.3 20.5,11.3 v20.6,11.4
ROT_R  (via drill 0.3)
  Top 0.15: S1.4 5.95,18.75 v5.2,19.5 | v20.6,15 21.48,15 21.71,14.77 23.33,14.77 IC1.36
  Bottom 0.305: v20.6,15 19.4,15 18.52,14.12 8.32,14.12 7.32,15.12 7.32,17.38 v5.2,19.5
RST_AT
  Top 0.15: IC1.13 30.27,11.03 30.72,11.03 30.88,10.87 30.88,9.78 R3.1 31.6,9.23 32.27,9.91 32.27,10.32 32.84,10.89 32.84,12.66 32.97,12.8 34.75,12.8 ST1.A1
RX
  Top 0.15: R_RA2.2 7.05,23.82 7.41,24.18 7.58,24.18 IC2.17 8.35,24.3 R_RA1.1
SCLK  (via drill 0.2, 0.3, 0.35)
  Top 0.15: IC1.9 28.3,9.2 29.7,7.8 35.23,7.8 ST1.A4 | J1.31 16.25,21.75 v18,21.7 | IC3.6 23.52,26.39 23.52,26.8 22.91,27.4 v22.3,27.4 | v23.4,23.3 26.9,19.8 27.35,19.8 27.45,19.7 v29.3,19.7 | v31.68,20.08 32.36,20.08 32.66,20.38 33.29,20.38 33.42,20.51 33.42,21.07 P1.5
  Top 0.152: J1.31 14.89,21.82 14.29,21.82 14.11,22.01 14.11,26.4 12.98,27.53 12.67,27.53 IC2.29
  Top 0.305: ST1.A4 35.23,6.73 v35.2,6.7
  Bottom 0.15: v18,21.7 21.8,21.7 v23.4,23.3 23.4,26.3 v22.3,27.4 | v29.3,19.7 31.3,19.7 v31.68,20.08
  Bottom 0.305: v35.2,6.7 32.4,9.5 32.4,15.8 29.36,18.84 29.36,19.64 | 29.36,19.64 29.36,19.66 29.4,19.7 | 29.36,19.64 v29.3,19.7
SD_SS
  Top 0.15: IC1.18 30.27,13.78 30.72,13.78 31.8,14.85 31.8,16.22 30.8,17.22 30.8,21.45 P1.2
SWITCH  (via drill 0.3)
  Top 0.15: S1.T 6.62,15.75 5.93,15.06 5.41,15.06 5.2,14.86 v5.2,14.9 | IC1.38 23.32,13.53 22.88,13.53 22.55,13.2 v20.6,13.2
  Bottom 0.305: v20.6,13.2 20.5,13.2 19.51,12.21 18.03,12.21 17.03,13.21 7.63,13.21 6.79,14.05 6.04,14.05 5.43,14.67 | 5.43,14.67 5.32,14.78 | v5.2,14.9 5.43,14.67
SWITCH_L  (via drill 0.3)
  Top 0.15: S1.3 6.62,17.25 5.73,18.14 5.36,18.14 v5.2,18.3 | v20.6,14.1 23.4,14.1 IC1.37
  Bottom 0.305: v5.2,18.3 5.28,18.22 5.76,18.22 6.77,17.21 6.77,15.03 8.14,13.66 20.14,13.66 20.33,13.86 20.36,13.86 v20.6,14.1
SWITCH_R  (via drill 0.3)
  Top 0.15: S1.2 5.85,14.25 v5.2,13.6 | IC1.39 23.32,13.03 22.88,13.03 22.15,12.3 v20.6,12.3
  Bottom 0.305: v5.2,13.6 6.6,13.6 7.45,12.76 16.84,12.76 17.84,11.76 20.03,11.76 20.33,12.06 20.36,12.06 v20.6,12.3
TFT_AD
  Top 0.15: IC1.29 26.18,16.62 26.18,17.07 25.72,17.52 22.6,17.52 20.57,19.55 20.25,19.55 18.7,21.1 15.21,21.2 J1.30
TFT_RST
  Top 0.15: IC1.30 25.68,16.62 25.68,17.07 25.52,17.23 22.48,17.23 22.41,17.29 22.4,17.3 20.45,19.25 20.13,19.25 20,19.38 15.12,19.38 15.07,19.32 15.04,19.32 J1.26
TFT_SS
  Top 0.15: IC1.28 26.68,16.62 26.68,17.07 25.92,17.82 22.72,17.82 18.22,22.32 15.16,22.32 J1.32
TX1
  Top 0.125: 10.83,31.28 9.94,30.84 9.18,30.5 8.37,30.5 | 8.37,30.5 8.2,30.5 | IC2.11 7.51,28.29 7.22,28.29 7.01,28.5 7.01,29.3 8.2,30.49 8.36,30.49 8.37,30.5
  Top 0.15: L_A1.1 10.75,31.3 10.83,31.28 | 7.53,28.27 IC2.11
TX2
  Top 0.15: L_A2.1 7.6,27.1 IC2.13
VMID
  Top 0.15: C_RA2.2 5.92,24.99 R_RA2.1 7.12,25.12 IC2.16